# Altium schematic sheet uSD_Card.SchDoc
size A4; SheetNumber: 4; SheetTotal: 10
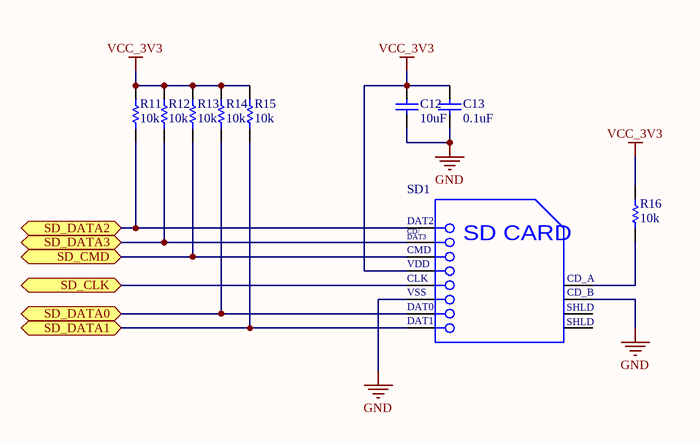
[diagram p0: uSD_Card.SchDoc]

## Parts
C12  10uF  [0805_C_S]
C13  0.1uF  [0805_C_S]
R11  10k  [0805_R_S]
R12  10k  [0805_R_S]
R13  10k  [0805_R_S]
R14  10k  [0805_R_S]
R15  10k  [0805_R_S]
R16  10k  [0805_R_S]
SD1  104031-0811  [MOLX-104031-0811_V]  (value not drawn)

## Ports
SD_CLK (bidir), SD_CMD (bidir), SD_DATA0 (bidir), SD_DATA1 (bidir), SD_DATA2 (bidir), SD_DATA3 (bidir)

## Nets
GND: C12.1 C13.1 SD1.6(VSS2) SD1.10(CD_B)
VCC_3V3: C12.2 C13.2 R11.1 R12.1 R13.1 R14.1 R15.1 R16.1 SD1.4(VDD)
SD_CLK: SD1.5(CLK) ; port SD_CLK
SD_CMD: R13.2 SD1.3(VSS1) ; port SD_CMD
SD_DATA0: R14.2 SD1.7(DAT0) ; port SD_DATA0
SD_DATA1: R15.2 SD1.8(DAT1) ; port SD_DATA1
SD_DATA2: R11.2 SD1.1(CD/DAT3) ; port SD_DATA2
SD_DATA3: R12.2 SD1.2(CMD) ; port SD_DATA3
NetR16_2: R16.2 SD1.9(CD_A)

Not connected (* = marked no-connect by the designer): SD1 11(SHLD1) 12(SHLD2)

## Notes on the sheet
- (in symbol CMP-2000-05825-1) DAT2; CD/; DAT3; SD CARD; VSS; SHLD

## Library data of the parts
C12 C13 = Cap: Capacitor; Published: 8-Jun-2000; LatestRevisionDate: 17-Jul-2002; LatestRevisionNote: Re-released for DXP Platform.; Publisher: Altium Limited
  C12: Value: 10uF
  C13: Value: 0.1uF
R11-R16 = Res1: Resistor; Published: 8-Jun-2000; LatestRevisionDate: 17-Jul-2002; LatestRevisionNote: Re-released for DXP Platform.; Publisher: Altium Limited; Value: 10k
SD1 = CMP-2000-05825-1: Micro SD Card, RA, -25 to 85 degC, 8-Pin SMD, RoHS, Tape and Reel; Voltage Rating: 10VAC/DC; Number of Contacts: 8; Insertion - Extraction Style: Push-Pull; Pitch: 1.1mm; Mating Cycles: 10000; Brand: Molex; Current Rating: 500mA; Manufacturer URL: http://www.molex.com/; Card Type: microSD; Mounting Type: Standard; Height: 1.42mm; Mounting Technology: SurfaceMount; Contact Plating: Gold; Product Category: MemoryCardConnectors; Package Description: 8-Pin Surface Mount Device, Body 11.95 x 11.4 mm, Pitch 1.1 mm; Datasheet URL: http://www.molex.com/pdm_docs/sd/1040310811_sd.pdf; Termination Style: SMD; Length: 11.4mm; Housing Material: LiquidCrystalPolymer(LCP); Orientation: RightAngle; RoHS: True; Contact Material: PhosphorBronze; Datasheet Version: Rev. E, 04/2006; Packaging: Reel; Manufacturer: Molex; Series: 104031; Product: CardConnectors; Number of Rows: 1Row; Package Reference: 104031-0811